# Altium schematic sheet MainBoard-20221122.SchDoc
size 558 x 431 mm; SheetNumber: 1; SheetTotal: 1
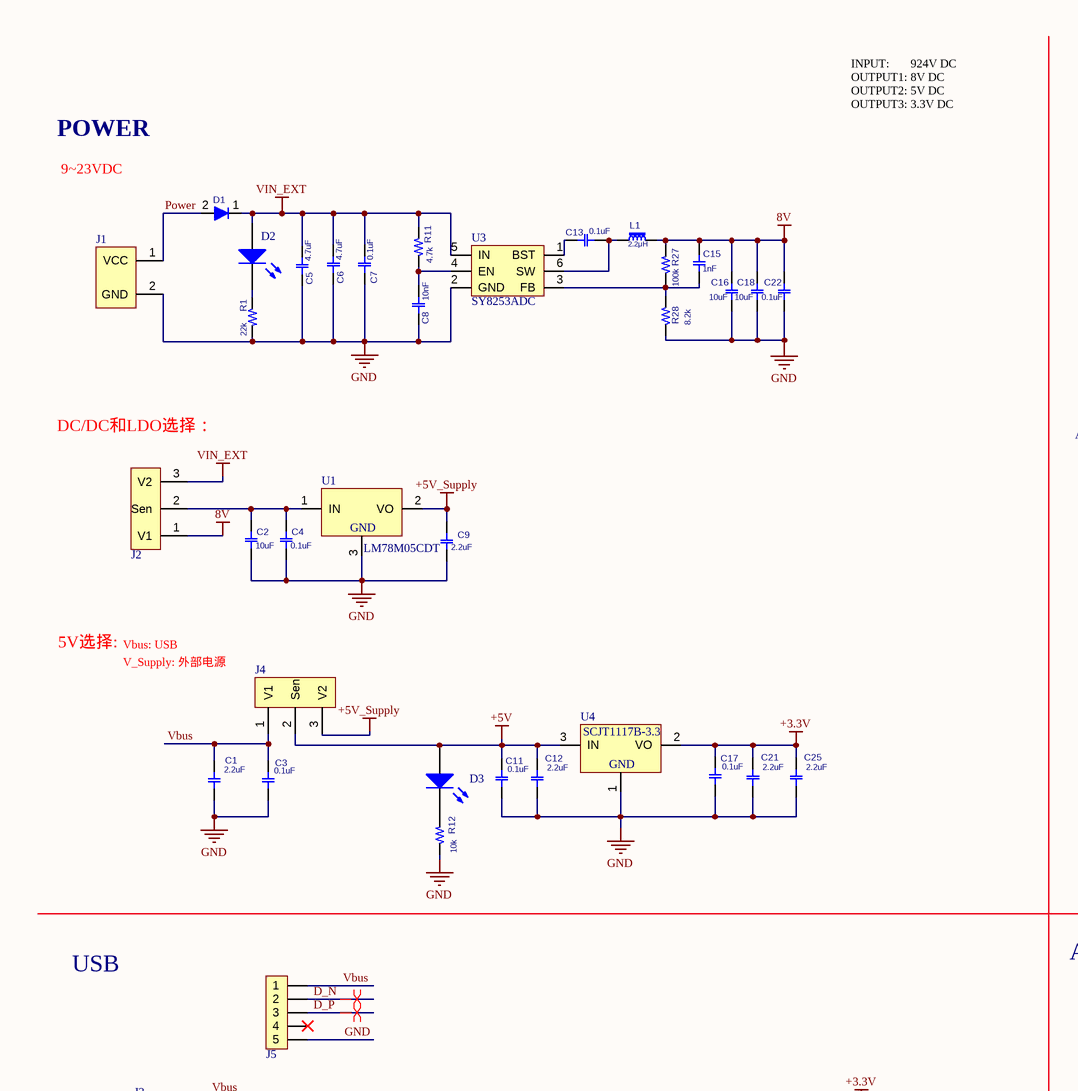
[diagram p0: MainBoard-20221122.SchDoc, top left]
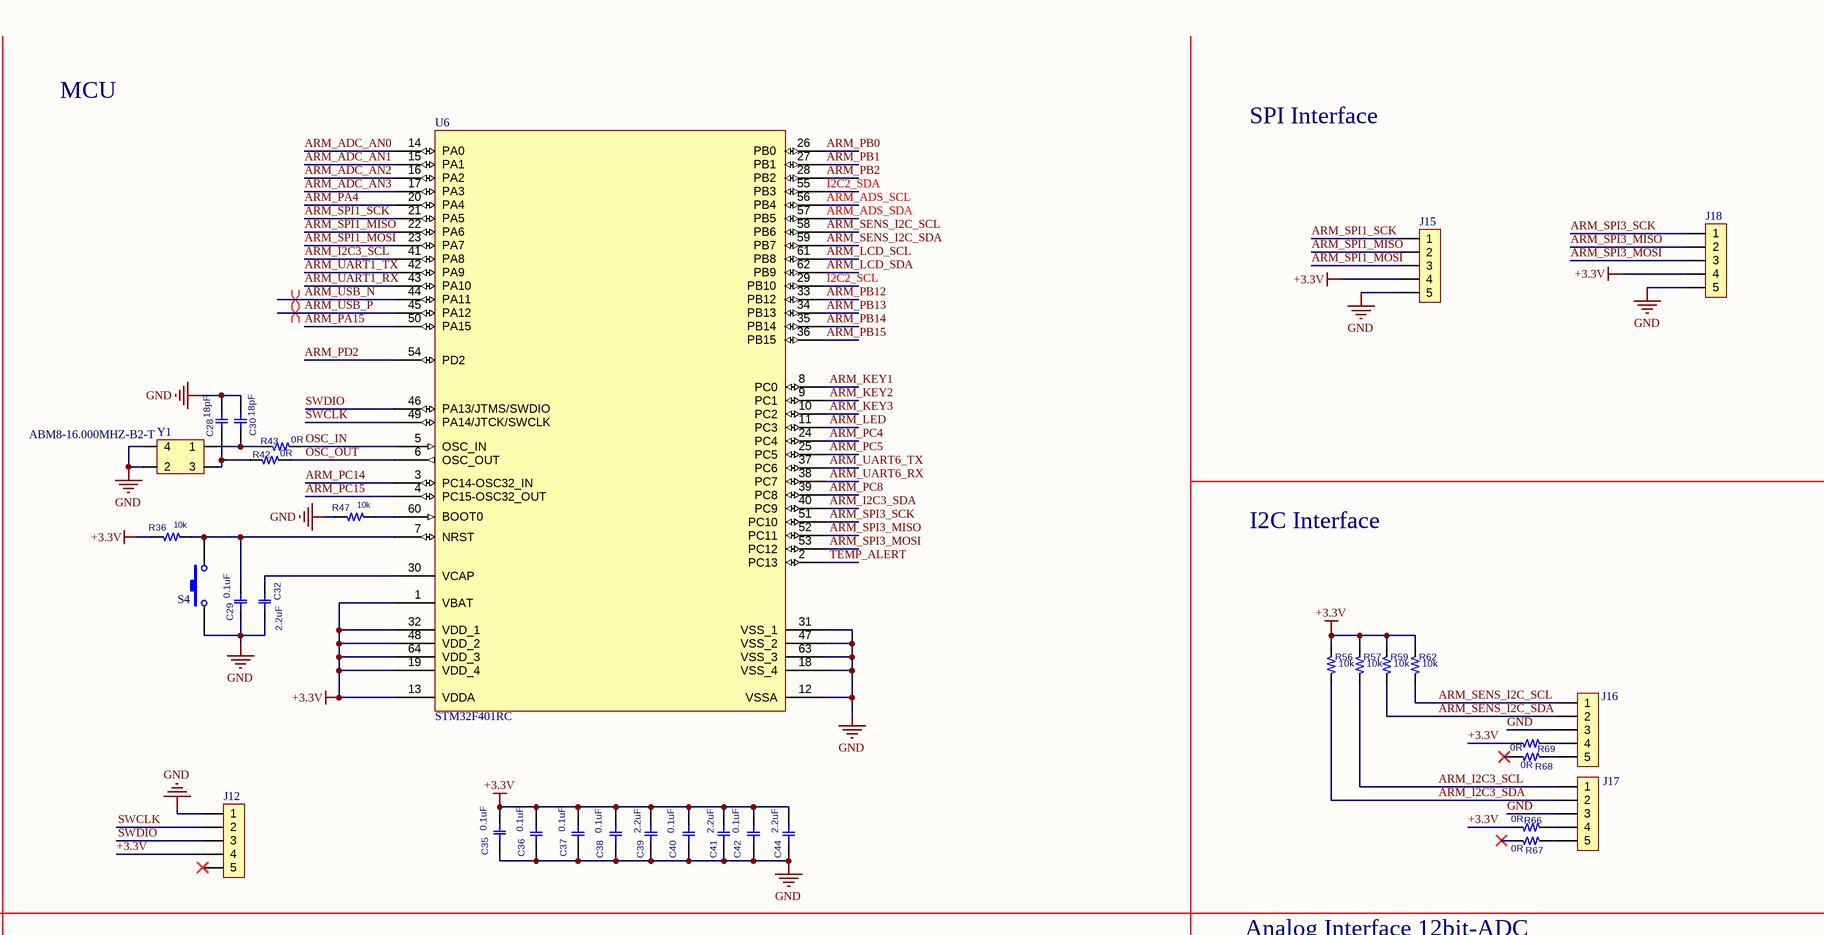
[diagram p1: MainBoard-20221122.SchDoc, top right]
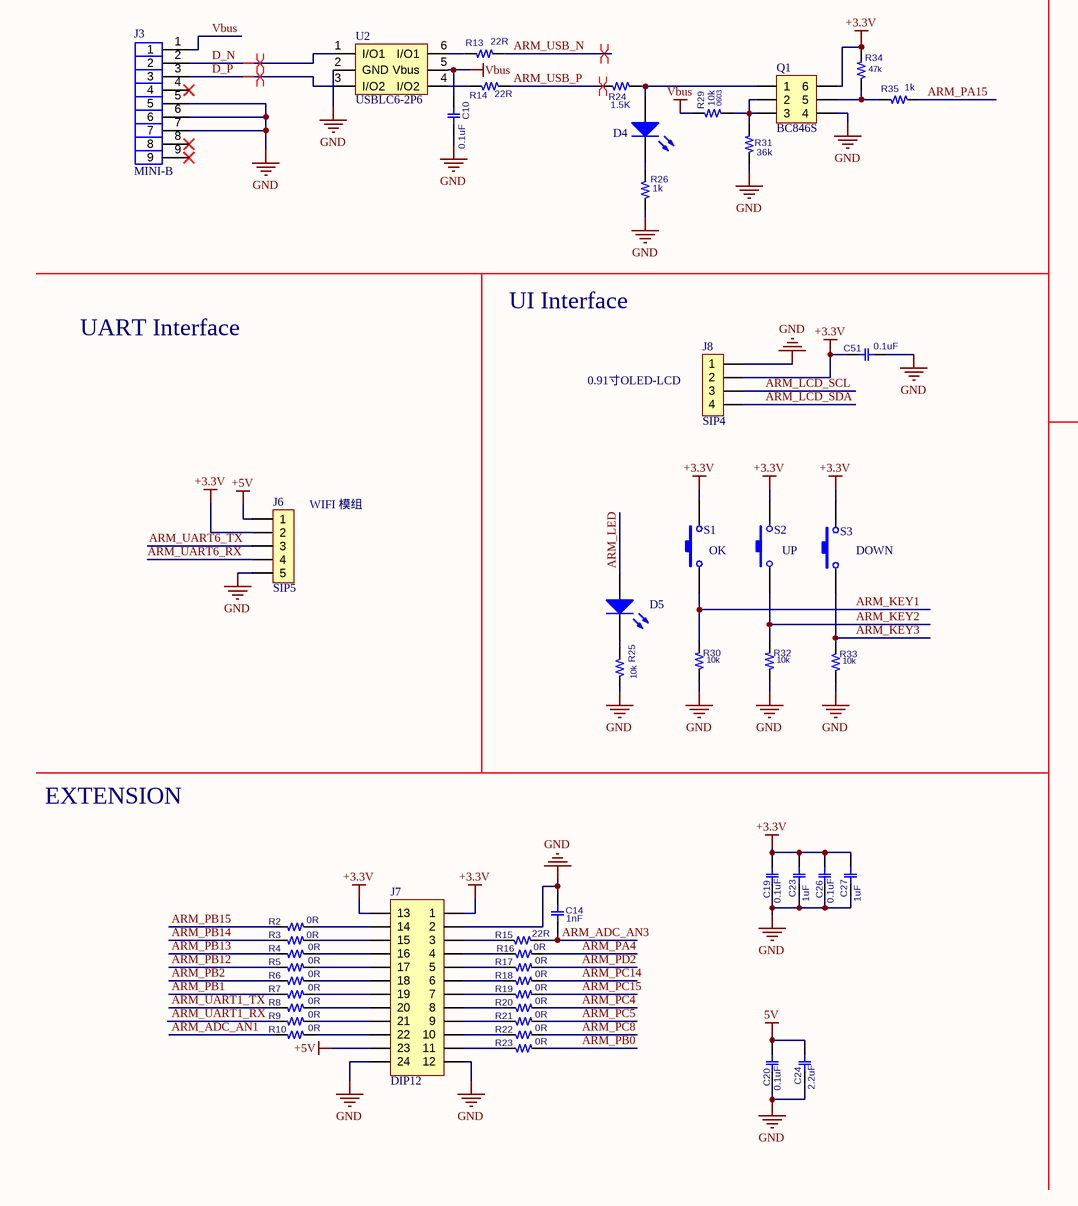
[diagram p2: MainBoard-20221122.SchDoc, bottom left]
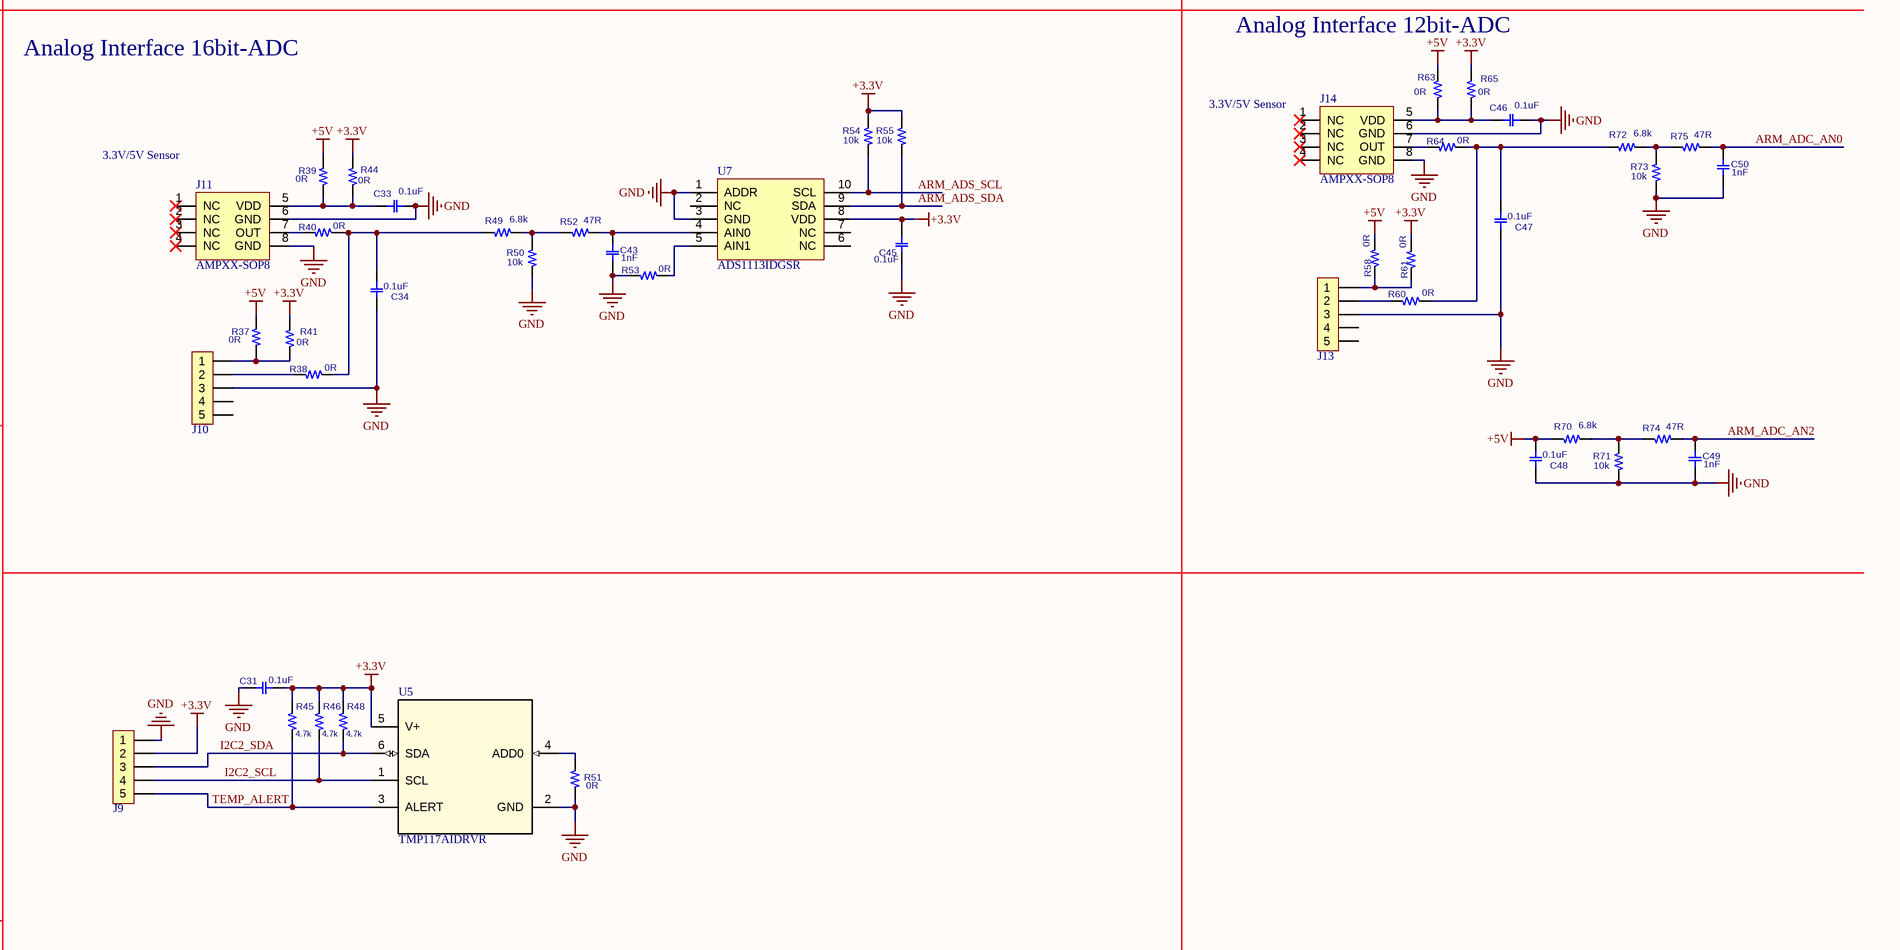
[diagram p3: MainBoard-20221122.SchDoc, bottom right]

## Parts
C1  value 2.2uF  [SMD-C-0603]  (hidden comment: JMK107B7105MAHT)
C2  value 10uF  [SMD-C-0805]  (hidden comment: GMK107BJ104MAHT)
C3  value 0.1uF  [SMD-C-0603]  (hidden comment: GMK107BJ104MAHT)
C4  value 0.1uF  [SMD-C-0603]  (hidden comment: GMK107BJ104MAHT)
C5  value 4.7uF  [SMD-C-1206]  (hidden comment: GMK107BJ104MAHT)
C6  value 4.7uF  [SMD-C-1206]  (hidden comment: GMK107BJ104MAHT)
C7  value 0.1uF  [SMD-C-0603]  (hidden comment: GMK107BJ104MAHT)
C8  value 10nF  [SMD-C-0603]  (hidden comment: GMK107BJ104MAHT)
C9  value 2.2uF  [SMD-C-0603]  (hidden comment: GMK107BJ104MAHT)
C10  value 0.1uF  [SMD-C-0603]  (hidden comment: GMK107BJ104MAHT)
C11  value 0.1uF  [SMD-C-0603]  (hidden comment: GMK107BJ104MAHT)
C12  value 2.2uF  [SMD-C-0603]  (hidden comment: JMK107B7105MAHT)
C13  value 0.1uF  [SMD-C-0603]  (hidden comment: GMK107BJ104MAHT)
C14  value 1nF  [SMD-C-0603]  (hidden comment: GMK107BJ104MAHT)
C15  value 1nF  [SMD-C-0603]  (hidden comment: GMK107BJ104MAHT)
C16  value 10uF  [SMD-C-0805]  (hidden comment: GMK107BJ104MAHT)
C17  value 0.1uF  [SMD-C-0603]  (hidden comment: GMK107BJ104MAHT)
C18  value 10uF  [SMD-C-0805]  (hidden comment: GMK107BJ104MAHT)
C19  value 0.1uF  [SMD-C-0603]  (hidden comment: GMK107BJ104MAHT)
C20  value 0.1uF  [SMD-C-0603]  (hidden comment: GMK107BJ104MAHT)
C21  value 2.2uF  [SMD-C-0603]  (hidden comment: JMK107B7105MAHT)
C22  value 0.1uF  [SMD-C-0603]  (hidden comment: GMK107BJ104MAHT)
C23  value 1uF  [SMD-C-0603]  (hidden comment: GMK107BJ104MAHT)
C24  value 2.2uF  [SMD-C-0603]  (hidden comment: GMK107BJ104MAHT)
C25  value 2.2uF  [SMD-C-0603]  (hidden comment: JMK107B7105MAHT)
C26  value 0.1uF  [SMD-C-0603]  (hidden comment: GMK107BJ104MAHT)
C27  value 1uF  [SMD-C-0603]  (hidden comment: GMK107BJ104MAHT)
C28  value 18pF  [SMD-C-0603]  (hidden comment: GMK107BJ104MAHT)
C29  value 0.1uF  [SMD-C-0603]  (hidden comment: GMK107BJ104MAHT)
C30  value 18pF  [SMD-C-0603]  (hidden comment: GMK107BJ104MAHT)
C31  value 0.1uF  [SMD-C-0603]  (hidden comment: GMK107BJ104MAHT)
C32  value 2.2uF  [SMD-C-0603]  (hidden comment: JMK107B7105MAHT)
C33  value 0.1uF  [SMD-C-0603]  (hidden comment: GMK107BJ104MAHT)
C34  value 0.1uF  [SMD-C-0603]  (hidden comment: GMK107BJ104MAHT)
C35  value 0.1uF  [SMD-C-0603]  (hidden comment: GMK107BJ104MAHT)
C36  value 0.1uF  [SMD-C-0603]  (hidden comment: GMK107BJ104MAHT)
C37  value 0.1uF  [SMD-C-0603]  (hidden comment: GMK107BJ104MAHT)
C38  value 0.1uF  [SMD-C-0603]  (hidden comment: GMK107BJ104MAHT)
C39  value 2.2uF  [SMD-C-0603]  (hidden comment: JMK107B7105MAHT)
C40  value 0.1uF  [SMD-C-0603]  (hidden comment: GMK107BJ104MAHT)
C41  value 2.2uF  [SMD-C-0603]  (hidden comment: JMK107B7105MAHT)
C42  value 0.1uF  [SMD-C-0603]  (hidden comment: GMK107BJ104MAHT)
C43  value 1nF  [SMD-C-0603]  (hidden comment: GMK107BJ104MAHT)
C44  value 2.2uF  [SMD-C-0603]  (hidden comment: JMK107B7105MAHT)
C45  value 0.1uF  [SMD-C-0603]  (hidden comment: GMK107BJ104MAHT)
C46  value 0.1uF  [SMD-C-0603]  (hidden comment: GMK107BJ104MAHT)
C47  value 0.1uF  [SMD-C-0603]  (hidden comment: GMK107BJ104MAHT)
C48  value 0.1uF  [SMD-C-0603]  (hidden comment: GMK107BJ104MAHT)
C49  value 1nF  [SMD-C-0603]  (hidden comment: GMK107BJ104MAHT)
C50  value 1nF  [SMD-C-0603]  (hidden comment: GMK107BJ104MAHT)
C51  value 0.1uF  [SMD-C-0603]  (hidden comment: GMK107BJ104MAHT)
D1  SK54BL  [SMD-D-SMA]  (value not drawn)
D2  LED1  [LED0603]  (value not drawn)
D3  LED1  [LED0603]  (value not drawn)
D4  LED1  [LED0603]  (value not drawn)
D5  LED1  [LED0603]  (value not drawn)
J1  SIP2  [SIP2]  (value not drawn)
J2  SIP3-3  [SIP3]  (value not drawn)
J3  MINI-B  [usb]
J4  SIP3-3  [SIP3]  (value not drawn)
J5  SIP5  [SIP5]  (value not drawn)
J6  SIP5  [SIP5]
J7  DIP12  [DIP12]
J8  SIP4  [OLED]
J9  SIP5  [SIP5]  (value not drawn)
J10  SIP5  [SIP5]  (value not drawn)
J11  AMPXX-SOP8  [AMP8220-L]
J12  SIP5  [SIP5]  (value not drawn)
J13  SIP5  [SIP5]  (value not drawn)
J14  AMPXX-SOP8  [AMP8220-L]
J15  SIP5  [SIP5]  (value not drawn)
J16  SIP5  [SIP5]  (value not drawn)
J17  SIP5  [SIP5]  (value not drawn)
J18  SIP5  [SIP5]  (value not drawn)
L1  Inductance: 2.2μH  [SMD-L-YZL-8040-8x8x4]  (hidden comment: YZL-8040-6R8M-LF)
Q1  BC846S  [SOT363]
R1  value 22k  [SMD-R-0603]  (hidden comment: CR-03FA7--100R)
R2  value 0R  [SMD-R-0603]  (hidden comment: CR-03FA7--100R)
R3  value 0R  [SMD-R-0603]  (hidden comment: CR-03FA7--100R)
R4  value 0R  [SMD-R-0603]  (hidden comment: CR-03FA7--100R)
R5  value 0R  [SMD-R-0603]  (hidden comment: CR-03FA7--100R)
R6  value 0R  [SMD-R-0603]  (hidden comment: CR-03FA7--100R)
R7  value 0R  [SMD-R-0603]  (hidden comment: CR-03FA7--100R)
R8  value 0R  [SMD-R-0603]  (hidden comment: CR-03FA7--100R)
R9  value 0R  [SMD-R-0603]  (hidden comment: CR-03FA7--100R)
R10  value 0R  [SMD-R-0603]  (hidden comment: CR-03FA7--100R)
R11  value 4.7k  [SMD-R-0603]  (hidden comment: CR-03FA7--100R)
R12  value 10k  [SMD-R-0603]  (hidden comment: CR-03FA7--100R)
R13  value 22R  [SMD-R-0603]  (hidden comment: CR-03FA7--100R)
R14  value 22R  [SMD-R-0603]  (hidden comment: CR-03FA7--100R)
R15  value 22R  [SMD-R-0603]  (hidden comment: CR-03FA7--100R)
R16  value 0R  [SMD-R-0603]  (hidden comment: CR-03FA7--100R)
R17  value 0R  [SMD-R-0603]  (hidden comment: CR-03FA7--100R)
R18  value 0R  [SMD-R-0603]  (hidden comment: CR-03FA7--100R)
R19  value 0R  [SMD-R-0603]  (hidden comment: CR-03FA7--100R)
R20  value 0R  [SMD-R-0603]  (hidden comment: CR-03FA7--100R)
R21  value 0R  [SMD-R-0603]  (hidden comment: CR-03FA7--100R)
R22  value 0R  [SMD-R-0603]  (hidden comment: CR-03FA7--100R)
R23  value 0R  [SMD-R-0603]  (hidden comment: CR-03FA7--100R)
R24  value 1.5K  [SMD-R-0603]  (hidden comment: CR-03FA7--100R)
R25  value 10k  [SMD-R-0603]  (hidden comment: CR-03FA7--100R)
R26  value 1k  [SMD-R-0603]  (hidden comment: CR-03FA7--100R)
R27  value 100k  [SMD-R-0603]  (hidden comment: CR-03FA7--100R)
R28  value 8.2k  [SMD-R-0603]  (hidden comment: CR-03FA7--100R)
R29  value 10k  Package or Case: 0603  [SMD-R-0603]  (hidden comment: CR-03FA7--100R)
R30  value 10k  [SMD-R-0603]  (hidden comment: CR-03FA7--100R)
R31  value 36k  [SMD-R-0603]  (hidden comment: CR-03FA7--100R)
R32  value 10k  [SMD-R-0603]  (hidden comment: CR-03FA7--100R)
R33  value 10k  [SMD-R-0603]  (hidden comment: CR-03FA7--100R)
R34  value 47k  [SMD-R-0603]  (hidden comment: CR-03FA7--100R)
R35  value 1k  [SMD-R-0603]  (hidden comment: CR-03FA7--100R)
R36  value 10k  [SMD-R-0603]  (hidden comment: CR-03FA7--100R)
R37  value 0R  [SMD-R-0603]  (hidden comment: CR-03FA7--100R)
R38  value 0R  [SMD-R-0603]  (hidden comment: CR-03FA7--100R)
R39  value 0R  [SMD-R-0603]  (hidden comment: CR-03FA7--100R)
R40  value 0R  [SMD-R-0603]  (hidden comment: CR-03FA7--100R)
R41  value 0R  [SMD-R-0603]  (hidden comment: CR-03FA7--100R)
R42  value 0R  [SMD-R-0603]  (hidden comment: CR-03FA7--100R)
R43  value 0R  [SMD-R-0603]  (hidden comment: CR-03FA7--100R)
R44  value 0R  [SMD-R-0603]  (hidden comment: CR-03FA7--100R)
R45  value 4.7k  [SMD-R-0603]  (hidden comment: CR-03FA7--100R)
R46  value 4.7k  [SMD-R-0603]  (hidden comment: CR-03FA7--100R)
R47  value 10k  [SMD-R-0603]  (hidden comment: CR-03FA7--100R)
R48  value 4.7k  [SMD-R-0603]  (hidden comment: CR-03FA7--100R)
R49  value 6.8k  [SMD-R-0603]  (hidden comment: CR-03FA7--100R)
R50  value 10k  [SMD-R-0603]  (hidden comment: CR-03FA7--100R)
R51  value 0R  [SMD-R-0603]  (hidden comment: CR-03FA7--100R)
R52  value 47R  [SMD-R-0603]  (hidden comment: CR-03FA7--100R)
R53  value 0R  [SMD-R-0603]  (hidden comment: CR-03FA7--100R)
R54  value 10k  [SMD-R-0603]  (hidden comment: CR-03FA7--100R)
R55  value 10k  [SMD-R-0603]  (hidden comment: CR-03FA7--100R)
R56  value 10k  [SMD-R-0603]  (hidden comment: CR-03FA7--100R)
R57  value 10k  [SMD-R-0603]  (hidden comment: CR-03FA7--100R)
R58  value 0R  [SMD-R-0603]  (hidden comment: CR-03FA7--100R)
R59  value 10k  [SMD-R-0603]  (hidden comment: CR-03FA7--100R)
R60  value 0R  [SMD-R-0603]  (hidden comment: CR-03FA7--100R)
R61  value 0R  [SMD-R-0603]  (hidden comment: CR-03FA7--100R)
R62  value 10k  [SMD-R-0603]  (hidden comment: CR-03FA7--100R)
R63  value 0R  [SMD-R-0603]  (hidden comment: CR-03FA7--100R)
R64  value 0R  [SMD-R-0603]  (hidden comment: CR-03FA7--100R)
R65  value 0R  [SMD-R-0603]  (hidden comment: CR-03FA7--100R)
R66  value 0R  [SMD-R-0603]  (hidden comment: CR-03FA7--100R)
R67  value 0R  [SMD-R-0603]  (hidden comment: CR-03FA7--100R)
R68  value 0R  [SMD-R-0603]  (hidden comment: CR-03FA7--100R)
R69  value 0R  [SMD-R-0603]  (hidden comment: CR-03FA7--100R)
R70  value 6.8k  [SMD-R-0603]  (hidden comment: CR-03FA7--100R)
R71  value 10k  [SMD-R-0603]  (hidden comment: CR-03FA7--100R)
R72  value 6.8k  [SMD-R-0603]  (hidden comment: CR-03FA7--100R)
R73  value 10k  [SMD-R-0603]  (hidden comment: CR-03FA7--100R)
R74  value 47R  [SMD-R-0603]  (hidden comment: CR-03FA7--100R)
R75  value 47R  [SMD-R-0603]  (hidden comment: CR-03FA7--100R)
S1  SW-PB  [SMD-SW-2]  (value not drawn)
S2  SW-PB  [SMD-SW-2]  (value not drawn)
S3  SW-PB  [SMD-SW-2]  (value not drawn)
S4  SW-PB  [SMD-SW-2]  (value not drawn)
U1  LM78M05CDT  [TO-252]
U2  USBLC6-2P6  [SOT-666]
U3  SY8253ADC  [SOT23-6]
U4  SCJT1117B-3.3  [SMD-SOT223]
U5  TMP117AIDRVR  [TMP117]
U6  STM32F401RC  [STM32F401RCT6]
U7  ADS1113IDGSR  [VSSOP-10]
Y1  ABM8-16.000MHZ-B2-T  [ABM8]

## Nets
5V: C20.1 C24.1
8V: C15.1 C16.1 C18.1 C22.1 J2.1(V1) L1.2 R27.1
+3.3V: C17.1 C19.1 C21.1 C23.1 C25.1 C26.1 C27.1 C31.2 C35.2 C36.2 C37.2 C38.1 C39.1 C40.1 C41.1 C42.1 C44.1 C45.1 C51.1 J6.2 J7.1 J7.13 J8.2 J9.2 J12.4 J15.4 J18.4 Q1.6 R34.1 R36.1 R41.2 R44.2 R45.1 R46.1 R48.1 R54.2 R55.2 R56.1 R57.1 R59.1 R61.2 R62.1 R65.2 R66.2 R69.2 S1.2 S2.2 S3.2 U4.2(VO) U5.5(V+) U6.1(VBAT) U6.13(VDDA) U6.19(VDD_4) U6.32(VDD_1) U6.48(VDD_2) U6.64(VDD_3) U7.8(VDD)
+5V: C11.1 C12.1 C48.2 D3.1(A) J4.2(Sen) J6.1 J7.23 R37.2 R39.2 R58.2 R63.2 R70.1 U4.3(IN)
+5V_Supply: C9.1 J4.3(V2) U1.2(VO)
GND: C1.2 C2.2 C3.2 C4.2 C5.2 C6.2 C7.2 C8.2 C9.2 C10.1 C11.2 C12.2 C14.2 C16.2 C17.2 C18.2 C19.2 C20.2 C21.2 C22.2 C23.2 C24.2 C25.2 C26.2 C27.2 C28.1 C29.2 C30.1 C31.1 C32.2 C33.1 C34.1 C35.1 C36.1 C37.1 C38.2 C39.2 C40.2 C41.2 C42.2 C43.1 C44.2 C45.2 C46.1 C47.1 C48.1 C49.1 C50.1 C51.2 J1.2(GND) J3.5 J3.6 J3.7 J5.5 J6.5 J7.2 J7.12 J7.24 J8.1 J9.1 J10.3 J11.6(GND) J11.8(GND) J12.1 J13.3 J14.6(GND) J14.8(GND) J15.5 J16.3 J17.3 J18.5 Q1.4 R1.2 R12.2 R25.2 R26.2 R28.2 R30.2 R31.2 R32.2 R33.2 R47.1 R50.1 R51.2 R53.1 R71.1 R73.1 S4.1 U1.3(GND) U2.2(GND) U3.2(GND) U4.1(GND) U5.2(GND) U6.12(VSSA) U6.18(VSS_4) U6.31(VSS_1) U6.47(VSS_2) U6.63(VSS_3) U7.1(ADDR) U7.3(GND) Y1.2 Y1.4
Vbus: C1.1 C3.1 C10.2 J3.1 J4.1(V1) J5.1 R29.1 U2.5(Vbus)
VIN_EXT: C5.1 C6.1 C7.1 D1.1(N-) D2.1(A) J2.3(V2) R11.1 U3.5(IN)
ARM_ADC_AN0: C50.2 R75.2 U6.14(PA0)
ARM_ADC_AN1: R10.2 U6.15(PA1)
ARM_ADC_AN2: C49.2 R74.2 U6.16(PA2)
ARM_ADC_AN3: C14.1 R15.2 U6.17(PA3)
ARM_ADS_SCL: R54.1 U6.56(PB4) U7.10(SCL)
ARM_ADS_SDA: R55.1 U6.57(PB5) U7.9(SDA)
ARM_I2C3_SCL: J17.1 R57.2 U6.41(PA8)
ARM_I2C3_SDA: J17.2 R56.2 U6.40(PC9)
ARM_KEY1: R30.1 S1.1 U6.8(PC0)
ARM_KEY2: R32.1 S2.1 U6.9(PC1)
ARM_KEY3: R33.1 S3.1 U6.10(PC2)
ARM_LCD_SCL: J8.3 U6.61(PB8)
ARM_LCD_SDA: J8.4 U6.62(PB9)
ARM_LED: D5.1(A) U6.11(PC3)
ARM_PA4: R16.2 U6.20(PA4)
ARM_PA15: R35.2 U6.50(PA15)
ARM_PB0: R23.2 U6.26(PB0)
ARM_PB1: R7.2 U6.27(PB1)
ARM_PB2: R6.2 U6.28(PB2)
ARM_PB12: R5.2 U6.33(PB12)
ARM_PB13: R4.2 U6.34(PB13)
ARM_PB14: R3.2 U6.35(PB14)
ARM_PB15: R2.2 U6.36(PB15)
ARM_PC4: R20.2 U6.24(PC4)
ARM_PC5: R21.2 U6.25(PC5)
ARM_PC8: R22.2 U6.39(PC8)
ARM_PC14: R18.2 U6.3(PC14-OSC32_IN)
ARM_PC15: R19.2 U6.4(PC15-OSC32_OUT)
ARM_PD2: R17.2 U6.54(PD2)
ARM_SENS_I2C_SCL: J16.1 R62.2 U6.58(PB6)
ARM_SENS_I2C_SDA: J16.2 R59.2 U6.59(PB7)
ARM_SPI1_MISO: J15.2 U6.22(PA6)
ARM_SPI1_MOSI: J15.3 U6.23(PA7)
ARM_SPI1_SCK: J15.1 U6.21(PA5)
ARM_SPI3_MISO: J18.2 U6.52(PC11)
ARM_SPI3_MOSI: J18.3 U6.53(PC12)
ARM_SPI3_SCK: J18.1 U6.51(PC10)
ARM_UART1_RX: R9.2 U6.43(PA10)
ARM_UART1_TX: R8.2 U6.42(PA9)
ARM_UART6_RX: J6.4 U6.38(PC7)
ARM_UART6_TX: J6.3 U6.37(PC6)
ARM_USB_N: R13.2 U6.44(PA11)
ARM_USB_P: R14.2 R24.1 U6.45(PA12)
D_N: J3.2 J5.2 U2.1(I/O1)
D_P: J3.3 J5.3 U2.3(I/O2)
I2C2_SCL: J9.4 R46.2 U5.1(SCL) U6.29(PB10)
I2C2_SDA: J9.3 R48.2 U5.6(SDA) U6.55(PB3)
OSC_IN: R43.2 U6.5(OSC_IN)
OSC_OUT: R42.2 U6.6(OSC_OUT)
Power: D1.2(P+) J1.1(VCC)
SWCLK: J12.2 U6.49(PA14/JTCK/SWCLK)
SWDIO: J12.3 U6.46(PA13/JTMS/SWDIO)
TEMP_ALERT: J9.5 R45.2 U5.3(ALERT) U6.2(PC13)
NetC2_1: C2.1 C4.1 J2.2(Sen) U1.1(IN)
NetC8_1: C8.1 R11.2 U3.4(EN)
NetC13_1: C13.1 U3.1(BST)
NetC13_2: C13.2 L1.1 U3.6(SW)
NetC15_2: C15.2 R27.2 R28.1 U3.3(FB)
NetC28_2: C28.2 R42.1 Y1.3
NetC29_1: C29.1 R36.2 S4.2 U6.7(NRST)
NetC30_2: C30.2 R43.1 Y1.1
NetC32_1: C32.1 U6.30(VCAP)
NetC33_2: C33.2 J11.5(VDD) R39.1 R44.1
NetC34_2: C34.2 R38.2 R40.2 R49.1
NetC43_2: C43.2 R52.2 U7.4(AIN0)
NetC46_2: C46.2 J14.5(VDD) R63.1 R65.1
NetC47_2: C47.2 R60.2 R64.2 R72.1
NetD2_2: D2.2(K) R1.1
NetD3_2: D3.2(K) R12.1
NetD4_1: D4.1(A) Q1.1 R24.2
NetD4_2: D4.2(K) R26.1
NetD5_2: D5.2(K) R25.1
NetJ7_3: J7.3 R15.1
NetJ7_4: J7.4 R16.1
NetJ7_5: J7.5 R17.1
NetJ7_6: J7.6 R18.1
NetJ7_7: J7.7 R19.1
NetJ7_8: J7.8 R20.1
NetJ7_9: J7.9 R21.1
NetJ7_10: J7.10 R22.1
NetJ7_11: J7.11 R23.1
NetJ7_14: J7.14 R2.1
NetJ7_15: J7.15 R3.1
NetJ7_16: J7.16 R4.1
NetJ7_17: J7.17 R5.1
NetJ7_18: J7.18 R6.1
NetJ7_19: J7.19 R7.1
NetJ7_20: J7.20 R8.1
NetJ7_21: J7.21 R9.1
NetJ7_22: J7.22 R10.1
NetJ10_1: J10.1 R37.1 R41.1
NetJ10_2: J10.2 R38.1
NetJ11_7: J11.7(OUT) R40.1
NetJ13_1: J13.1 R58.1 R61.1
NetJ13_2: J13.2 R60.1
NetJ14_7: J14.7(OUT) R64.1
NetJ16_4: J16.4 R69.1
NetJ16_5: J16.5 R68.1
NetJ17_4: J17.4 R66.1
NetJ17_5: J17.5 R67.1
NetQ1_2: Q1.2 Q1.3 R29.2 R31.1
NetQ1_5: Q1.5 R34.2 R35.1
NetR13_1: R13.1 U2.6(I/O1)
NetR14_1: R14.1 U2.4(I/O2)
NetR47_2: R47.2 U6.60(BOOT0)
NetR49_2: R49.2 R50.2 R52.1
NetR51_1: R51.1 U5.4(ADD0)
NetR53_2: R53.2 U7.5(AIN1)
NetR70_2: R70.2 R71.2 R74.1
NetR72_2: R72.2 R73.2 R75.1

Not connected (* = marked no-connect by the designer): J3 4* 8* 9*; J5 4*; J10 4 5; J11 1(NC)* 2(NC)* 3(NC)* 4(NC)*; J12 5*; J13 4 5; J14 1(NC)* 2(NC)* 3(NC)* 4(NC)*; R67 2*; R68 2*; U7 2(NC) 6(NC) 7(NC)

## Layout directives
differential pair: ARM_USB_N, ARM_USB_P, D_N, D_P

## Notes on the sheet
- POWER
- INPUT:       924V DC
  OUTPUT1: 8V DC
  OUTPUT2: 5V DC
  OUTPUT3: 3.3V DC
- MCU
- SPI Interface
- 9~23VDC
- (near J2) DC/DC和LDO选择：
- I2C Interface
- 5V选择:
- Vbus: USB
- V_Supply: 外部电源
- Analog Interface 16bit-ADC
- Analog Interface 12bit-ADC
- USB
- (near J14) 3.3V/5V Sensor
- (near J11) 3.3V/5V Sensor
- UI Interface
- UART Interface
- 0.91寸OLED-LCD
- (near J6) WIFI 模组
- (near S1) OK
- (near S2) UP
- (near S3) DOWN
- EXTENSION
- DWG. NO.
- REV.
- SHT.
- REVISION
- DESCRIPTION
- DATE
- APPROVED
- THIS DOCUMENT AND THE DATA DISCLOSED HEREIN OR HEREWITH IS THE PROPERTY OF ALTIUM LIMITED AND MAY BE FREELY DISTRIBUTED IN WHOLE. NO RIGHTS ARE RESERVED OR EXPRESS OR IMPLIED WARANTEE GIVEN.
- ENG:
- DSN:
- APPROVALS
- PROJECT
- DOCUMENT REVISION:
- DESIGN ITEM:
- CHK:
- BOM:
- REFERENCE DOCUMENTS
- PROJECT REVISION:
- TITLE
- FAB DWG:
- PCB DWG:
- ASSY DWG:
- SCALE:
- SIZE
- C
- CAGE CODE
- FILE NAME
- DWG NO.
- SHEET
- OF
- REV

## Library data of the parts
C1 C12 C21 C25 C32 C39 C41 C44 = SMD-C-JMK107B7105MAHT: CAP MLCC 1uF 6.3V X7R 20% 0603 AEC-Q200; Manufacturer: TAIYO; AEC: Q200; Temperature Coefficient: ±15%; Body Size: 1.6X0.8X0.8mm，PAD 0.35mm; Package or Case: 0603; Manufacturer Part Number: JMK107B7105MAHT; Category: Capacitor; Feature: MLCC; Max Operating Temperature: +125°C; Min Operating Temperature: -55 ℃; Cost (RMB): *; Cost (USD): *; Mounting Type: SMD; RoHs: YES; ComponentLink1Description: DATASHEET; ComponentLink1URL: https://ds.yuden.co.jp/TYCOMPAS/ut/detail?pn=JMK107B7105MAHT&u=M; Tolerance: 20%; Temperature Characteristics: X7R; Voltage Rating: 6.3V
C2-C11 C13-C20 C22-C24 C26-C31 C33-C38 C40 C42 C43 C45-C51 = SMD-C-GMK107BJ104MAHT: CAP MLCC 0.1uF 35V X5R 20% 0603 AEC-Q200; Manufacturer: TAIYO; AEC: Q200; Temperature Coefficient: ±15%; Package or Case: 0603; Manufacturer Part Number: GMK107BJ104MAHT; Category: Capacitor; Feature: MLCC; Max Operating Temperature: +85 ℃; Min Operating Temperature: -55 ℃; Cost (RMB): *; Cost (USD): *; Mounting Type: SMD; RoHs: YES; ComponentLink1Description: DATASHEET; ComponentLink1URL: https://ds.yuden.co.jp/TYCOMPAS/eu/detail?pn=GMK107BJ104MAHT&u=M; Tolerance: 20%; Temperature Characteristics: X5R; Voltage Rating: 35V
D1 = SMD-ZD-DO-214AC(SMA): DIODE SCHOTTKY 40V 5A SMB; Manufacturer: PANJIT; Manufacturer Part Number: D; AEC: No; PD: 235mW; Speed: Fast Recovery =< 500ns, > 200mA (Io); IFSM: 100A; VF: 0.46V; IR Max.: 100uA; VRMS: 28V; TJ: -55~150 °C; ComponentLink1Description: DATASHEET; Mounting Type: SMD; Cost (USD): *; Cost (RMB): *; RoHs: Yes; Category: Diodes; Feature: SCHOTTKY BARRIER RECTIFIER; IF(AV): 5A; VDC: 40V; VRRM: 40V; Package or Case: SMB
D2-D5 = LED1: Typical RED GaAs LED; Published: 8-Jun-2000; LatestRevisionDate: 08-Jul-2005; LatestRevisionNote: Mech Layer 1 removed.; PackageReference: LED-1; Publisher: Altium Limited; PackageDescription: LED; 2 Leads
J11 J14 = AMP8220
L1 = SMD-L-YZL-8040-6R8M-LF: INDUCTOR 6.8μH Isat 4A ±20%; Manufacturer: YLZ (益泽联); Irms: 5A; DCR: 50mΩ MAX; TEST Frequence: 100kHz,/1.0V; HIPOT: 1mA MAX; AEC: NO; Manufacturer Part Number: YZL-8040-6R8M-LF; Tolerance: ±20%; Category: Inductor; Feature: Inductor; Mounting Type: *; ComponentLink1Description: DATASHEET; ComponentLink1URL: https://cascoproducts.sharepoint.com/teams/engineering/ENGCHNSUZ/Forms/AllItems.aspx?id=%2Fteams%2Fengineering%2FENGCHNSUZ%2FAltium%20Designer%2FDatasheet%2FIn%20Use%2FSMD%2FInductor%2FYZL%2D8040%2D6R8M%2DLF%2Epdf&parent=%2Fteams%2Fengineering%2FENGCHNSUZ%2FAltium%20Designer%2FDatasheet%2FIn%20Use%2FSMD%2FInductor
R1-R28 R30-R75 = SMD-R-CR-03FA7--100R: 603 AEC-Q200; Manufacturer: VIKING; AEC: Q200; Power (Watts): 100mW; Tolerance: 1%; Package or Case: 0603; Manufacturer Part Number: CR-03FA7--100R; Category: RESISTORS; ROHS: YES; Mounting Type: SMD; Cost (RMB): *; Cost (USD): *; Feature: THICK FILM RESISTORS; Packaging: REEL; ComponentLink1Description: DATASHEET; ComponentLink1URL: https://www.viking.com.tw/en/category/Thick-Film-Resistor-CR..A-Series/Resistor-CR-A.html
R29 = SMD-R-CR-03FA7--100R: 603 AEC-Q200; Manufacturer: VIKING; AEC: Q200; Power (Watts): 100mW; Tolerance: 1%; Manufacturer Part Number: CR-03FA7--100R; Category: RESISTORS; ROHS: YES; Mounting Type: SMD; Cost (RMB): *; Cost (USD): *; Feature: THICK FILM RESISTORS; Packaging: REEL; ComponentLink1Description: DATASHEET; ComponentLink1URL: https://www.viking.com.tw/en/category/Thick-Film-Resistor-CR..A-Series/Resistor-CR-A.html
S1-S4 = SW-PB: Switch; Published: 24-Mar-1999; LatestRevisionDate: 17-Jul-2002; LatestRevisionNote: Re-released for DXP Platform.; PackageReference: SPST-2; Publisher: Altium Limited; PackageDescription: Switch; 2 Leads
U1 = LM78M05
U5 = TMP117
U7 = ADS1113
Y1 = Crystal